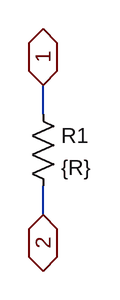
[diagram p0: schematic PiezoBeeper.asc]
PiezoBeeper.asc, the LTspice schematic file:
Version 4
SHEET 1 880 680
WIRE 176 160 176 128
WIRE 176 272 176 240
FLAG 176 128 1
IOPIN 176 128 BiDir
FLAG 176 272 2
IOPIN 176 272 BiDir
SYMBOL res 160 144 R0
SYMATTR InstName R1
SYMATTR Value {R}

The netlist it stands for:
* PiezoBeeper.asc
R1 1 2 {R}
.backanno
.end